# Altium schematic sheet RXMIX-SE.SchDoc: Receiver Mixer
size Legal; CheckedBy: J. Brinton; CompanyName: Signal Laboratories, Inc.; DrawnBy: J. Brinton; Engineer: J. Brinton; Address1: 3479 Edison Way; Address2: Menlo Park CA 94025; Address3: +1 (877) 778-8435; Address4: siglabs.com; DocumentNumber: 54; Revision: 2b; SheetNumber: 55; SheetTotal: 58
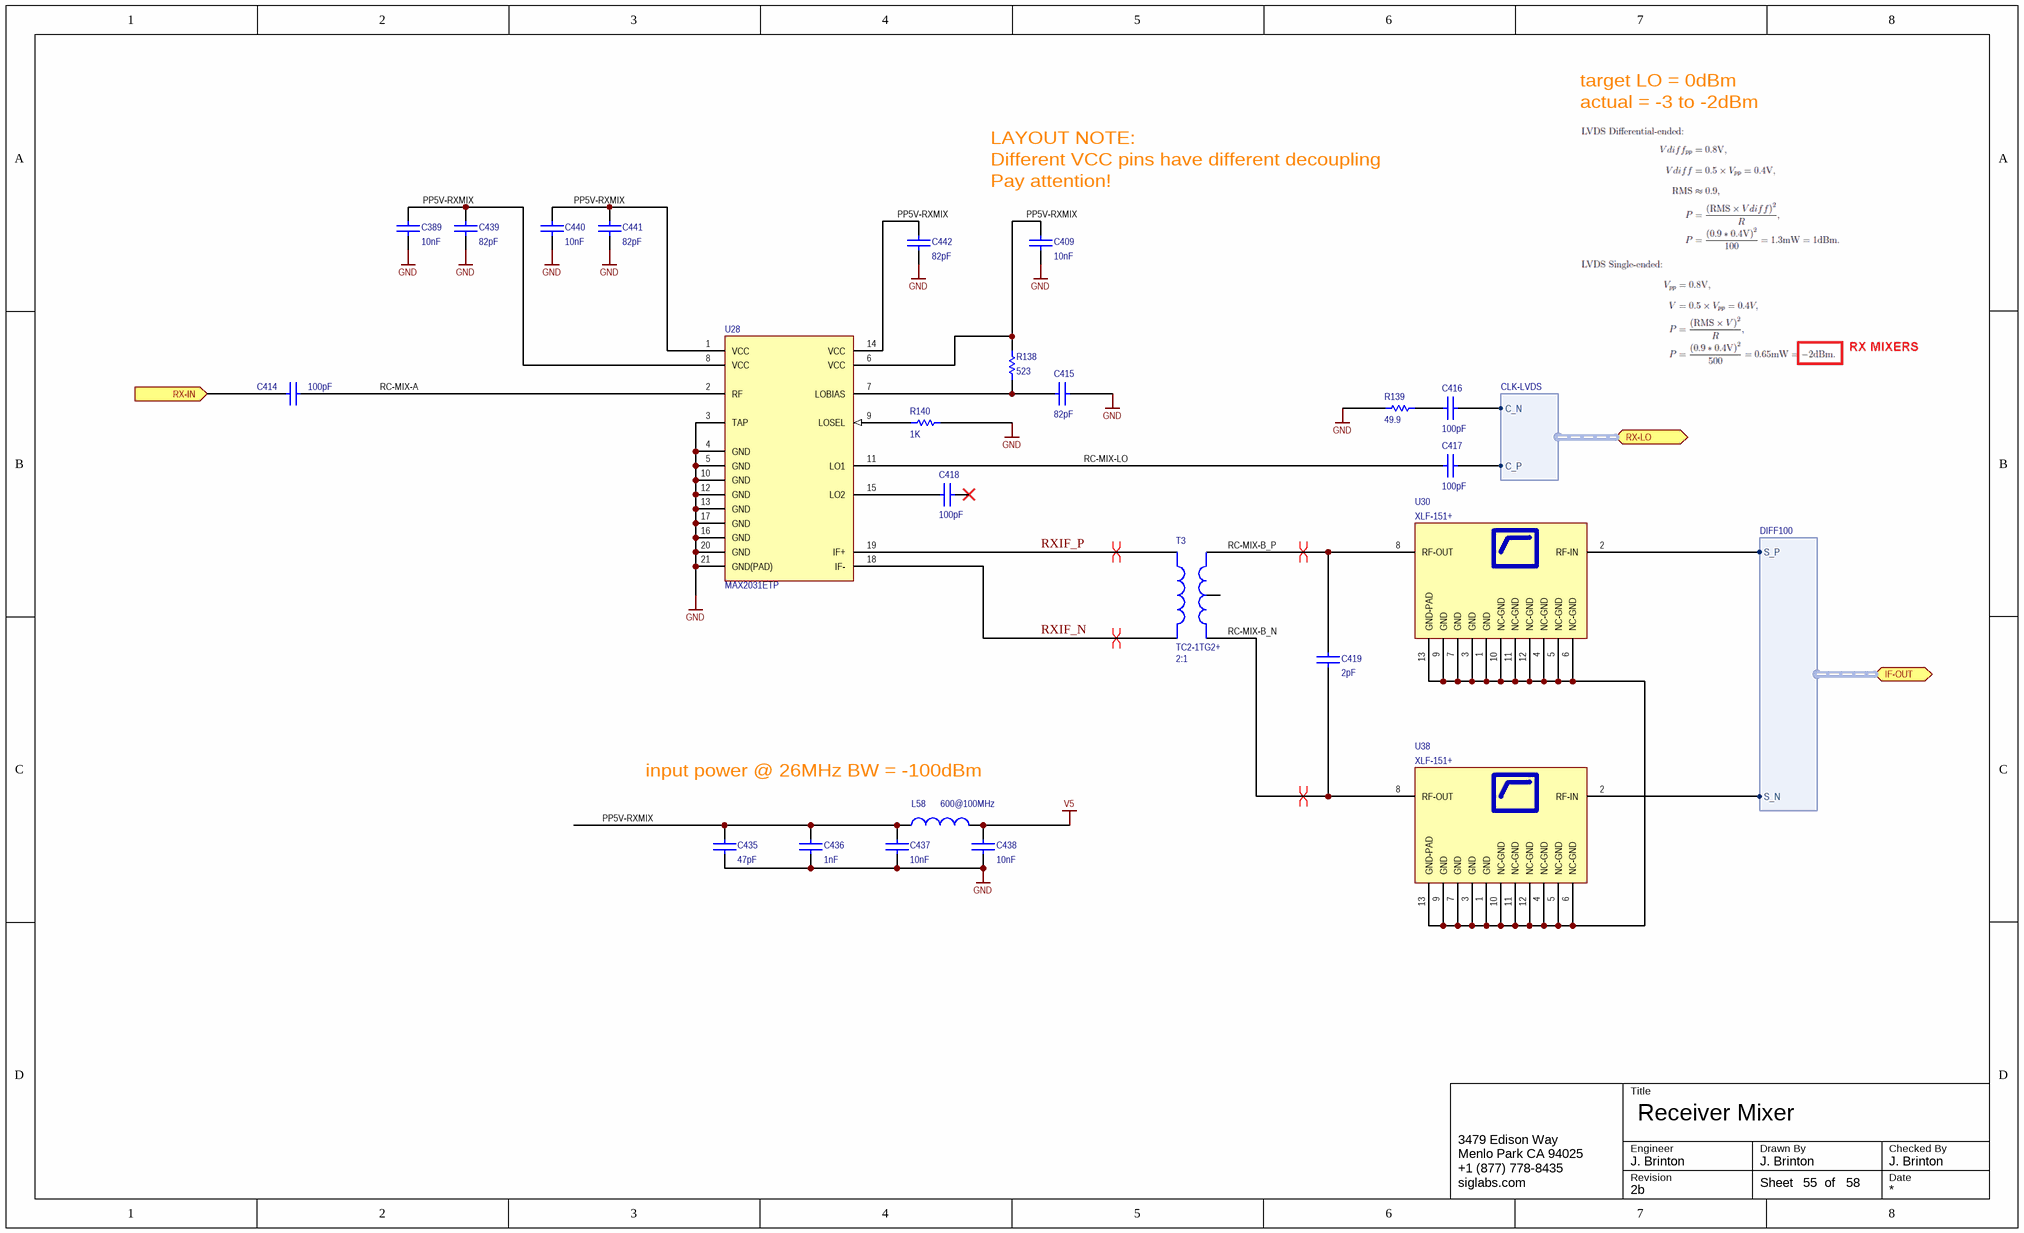
[diagram p0: RXMIX-SE.SchDoc]

## Parts
C389  value 10nF  [0402]  (hidden comment: GRM155R71E103KA01D)
C409  value 10nF  [0402]  (hidden comment: GRM155R71E103KA01D)
C414  value 100pF  [0402]  (hidden comment: CBR04C101F3GAC)
C415  value 82pF  [0402]  (hidden comment: VJ0402D820JXXAJ)
C416  value 100pF  [0402]  (hidden comment: CBR04C101F3GAC)
C417  value 100pF  [0402]  (hidden comment: CBR04C101F3GAC)
C418  value 100pF  [0402]  (hidden comment: CBR04C101F3GAC)
C419  value 2pF  [0402]  (hidden comment: GJM1555C1H2R0CB01D)
C435  value 47pF  [0402]  (hidden comment: CBR04C470F3GAC)
C436  value 1nF  [0402]  (hidden comment: GRM1555C1H102JA01D)
C437  value 10nF  [0402]  (hidden comment: GRM155R71E103KA01D)
C438  value 10nF  [0402]  (hidden comment: GRM155R71E103KA01D)
C439  value 82pF  [0402]  (hidden comment: VJ0402D820JXXAJ)
C440  value 10nF  [0402]  (hidden comment: GRM155R71E103KA01D)
C441  value 82pF  [0402]  (hidden comment: VJ0402D820JXXAJ)
C442  value 82pF  [0402]  (hidden comment: VJ0402D820JXXAJ)
L58  value 600@100MHz  [0402]  (hidden comment: BLM15PX601SN1D)
R138  value 523  [0603]  (hidden comment: RC0603FR-07523RL)
R139  value 49.9  [0603]  (hidden comment: ERJ-3EKF49R9V)
R140  value 1K  [0402]  (hidden comment: RC0402FR-071KL)
T3  value 2:1  [AT224-1A]  (hidden comment: TC2-1TG2+)
U28  MAX2031ETP  [QFN21P65_500X500X80L55X30T320N]
U30  XLF-151+  [QFN-XLF-12]
U38  XLF-151+  [QFN-XLF-12]

## Ports
IF-OUT (harness DIFF100), RX-IN (in), RX-LO (harness CLK-LVDS)

## Harnesses
CLK-LVDS: C_P, C_N
DIFF100: S_P, S_N

## Nets
GND: C389.1 C409.1 C415.2 C435.1 C436.1 C437.1 C438.1 C439.1 C440.1 C441.1 C442.1 R139.1 R140.2 U28.3(TAP) U28.4(GND) U28.5(GND) U28.10(GND) U28.12(GND) U28.13(GND) U28.16(GND) U28.17(GND) U28.20(GND) U28.21(GND(PAD))
V5: C438.2 L58.1
PP5V-RXMIX: C389.2 C409.2 C435.2 C436.2 C437.2 C439.2 C440.2 C441.2 C442.2 L58.2 R138.1 U28.1(VCC) U28.6(VCC) U28.8(VCC) U28.14(VCC)
RC-MIX-A: C414.2 U28.2(RF)
RC-MIX-B_N: C419.1 T3.1(Sec+) U38.8(RF-OUT)
RC-MIX-B_P: C419.2 T3.3(Sec-) U30.8(RF-OUT)
RC-MIX-LO: C417.1 U28.11(LO1)
RX-IN: C414.1 ; port RX-IN
RXIF_N: T3.6(Pri+) U28.18(IF-)
RXIF_P: T3.4(Pri-) U28.19(IF+)
NetC415_1: C415.1 R138.2 U28.7(LOBIAS)
NetC416_1: C416.1 R139.2
NetC416_2: C416.2 ; port RX-LO.C_N
NetC417_2: C417.2 ; port RX-LO.C_P
NetC418_1: C418.1 U28.15(LO2)
NetR140_1: R140.1 U28.9(LOSEL)
NetU30_1: U30.1(GND) U30.3(GND) U30.4(NC-GND) U30.5(NC-GND) U30.6(NC-GND) U30.7(GND) U30.9(GND) U30.10(NC-GND) U30.11(NC-GND) U30.12(NC-GND) U30.13(GND-PAD) U38.1(GND) U38.3(GND) U38.4(NC-GND) U38.5(NC-GND) U38.6(NC-GND) U38.7(GND) U38.9(GND) U38.10(NC-GND) U38.11(NC-GND) U38.12(NC-GND) U38.13(GND-PAD)
NetU30_2: U30.2(RF-IN) ; port IF-OUT.S_P
NetU38_2: U38.2(RF-IN) ; port IF-OUT.S_N

Not connected (* = marked no-connect by the designer): C418 2*; T3 2(SecCT)

## Layout directives
differential pair: RC-MIX-B_N, RC-MIX-B_P, RXIF_N, RXIF_P

## Notes on the sheet
- target LO = 0dBm
- actual = -3 to -2dBm
- LAYOUT NOTE:
- Different VCC pins have different decoupling
- (near C409) Pay attention!
- input power @ 26MHz BW = -100dBm
- Title
- Engineer
- Revision
- Drawn By
- Checked By
- Date
- Sheet
- of

## Library data of the parts
C389 C409 C437 C438 C440 = CAP 0402: Ceramic Capacitor 10nF ±10% 25V X7R 0402; Manufacturer: Murata; Tr: -55:125; Voltage: 25V; Manufacturer P/N: GRM155R71E103KA01D; Package: 0402; Tolerance: ±10%
C414 C416-C418 = CAP 0603: Ceramic Capacitor 100pF ±1% 25V NP0 0402; Manufacturer: Kemet; Tr: -55:125; Voltage: 25V; Manufacturer P/N: CBR04C101F3GAC; Package: 0402; Tolerance: ±1%
C415 C439 C441 C442 = CAP: Ceramic Capacitor 82pF ±5% 25V NP0 0402; Manufacturer: Vishay Vitramon; Tr: 55:125; Voltage: 25V; Manufacturer P/N: VJ0402D820JXXAJ; Tolerance: ±5%; Footprint: *; Package: 0402
C419 = CAP 0402: Ceramic Capacitor 2pF ±0.25pF 50V NP0 0402; Manufacturer: Murata; Tr: -55:125; Voltage: 50V; Manufacturer P/N: GJM1555C1H2R0CB01D; Package: 0402; Tolerance: ±0.25pF
C435 = CAP 0402: Ceramic Capacitor 47pF ±1% 25V NP0 0402; Manufacturer: Kemet; Tr: -55:125; Voltage: 25V; Manufacturer P/N: CBR04C470F3GAC; Package: 0402; Tolerance: ±1%
C436 = CAP 0402: Ceramic Capacitor 1nF ±5% 50V NP0 0402; Manufacturer: Murata; Tr: -55:125; Voltage: 50V; Manufacturer P/N: GRM1555C1H102JA01D; Package: 0402; Tolerance: ±5%
L58 = IND 0402: Ferrite Bead 600-Ohm @ 100MHz 900mA 0402; Manufacturer: Murata; Tolerance: ±25%; Tr: -55:125; Manufacturer P/N: BLM15PX601SN1D; Package: 0402
R138 = RES 0603: Thick Film Resistor 523 ±1% 0603; Manufacturer: Yageo; Tr: -55:155; Package: 0603; Manufacturer P/N: RC0603FR-07523RL; Tolerance: ±1%
R139 = RES 0603: Thick Film Resistor 49.9 ±1% 0603; Manufacturer: Panasonic; Tr: -55:155; Package: 0603; Manufacturer P/N: ERJ-3EKF49R9V; Tolerance: ±1%
R140 = RES 0402: Thick Film Resistor 1k ±1% 0402; Manufacturer: Yageo; Tr: -55:155; Package: 0402; Manufacturer P/N: RC0402FR-071KL; Do Not Place: *; Tolerance: ±1%
T3 = TC1-1TG2+: RF Transformer 0.4 to 500MHz SMD; Manufacturer: Mini-Circuits; Manufacturer P/N: TC2-1TG2+
U28 = MAX2031ETP: Upconversion/Downconversion Mixer; Manufacturer: Maxim; Manufacturer P/N: MAX2031ETP
U30 U38 = XLF-151+: Reflectionless Low-Pass Filter, DC-150Mhz; Manufacturer: Mini-Circuits; Manufacturer P/N: XLF-151+